# Altium schematic sheet E17-15-MCU.SchDoc
size A; DocumentNumber: 2; SheetNumber: 2; SheetTotal: 9
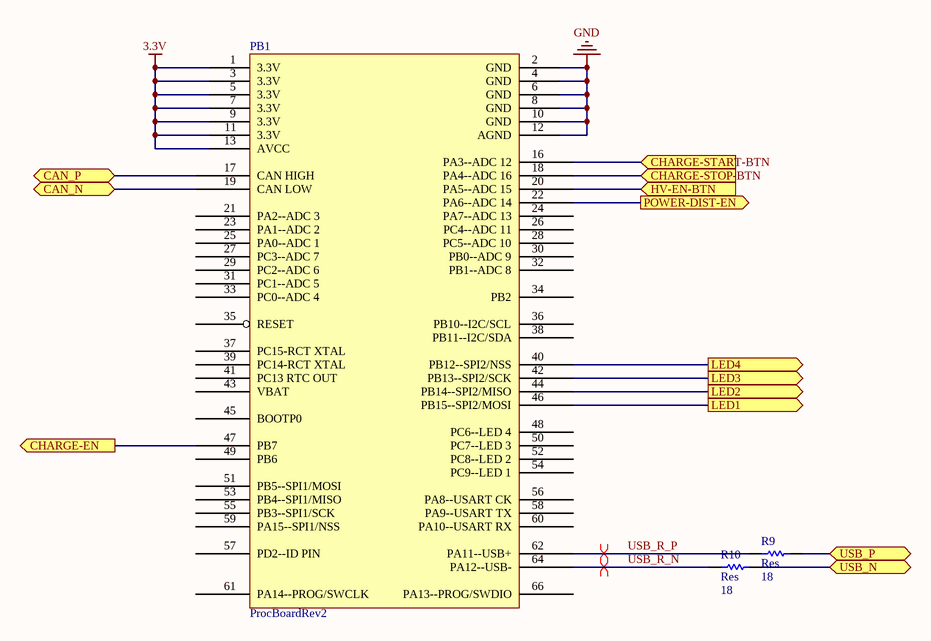
[diagram p0: E17-15-MCU.SchDoc]

## Parts
PB1  ProcBoardRev2  [PROC_BOARD]
R9  Res  value 18  [2012[0805]]
R10  Res  value 18  [2012[0805]]

## Ports
CAN_N (bidir), CAN_P (bidir), CHARGE-EN (out), CHARGE-START-BTN (in), CHARGE-STOP-BTN (in), HV-EN-BTN (in), LED1 (out), LED2 (out), LED3 (out), LED4 (out), POWER-DIST-EN (out), USB_N (bidir), USB_P (bidir)

## Nets
3.3V: PB1.1(3.3V) PB1.3(3.3V) PB1.5(3.3V) PB1.7(3.3V) PB1.9(3.3V) PB1.11(3.3V) PB1.13(AVCC)
GND: PB1.2(GND) PB1.4(GND) PB1.6(GND) PB1.8(GND) PB1.10(GND) PB1.12(AGND)
CAN_N: PB1.19(CAN_LOW) ; port CAN_N
CAN_P: PB1.17(CAN_HIGH) ; port CAN_P
CHARGE-EN: PB1.47(PB7) ; port CHARGE-EN
CHARGE-START-BTN: PB1.16(PA3--ADC_12) ; port CHARGE-START-BTN
CHARGE-STOP-BTN: PB1.18(PA4--ADC_16) ; port CHARGE-STOP-BTN
HV-EN-BTN: PB1.20(PA5--ADC_15) ; port HV-EN-BTN
LED1: PB1.46(PB15--SPI2/MOSI) ; port LED1
LED2: PB1.44(PB14--SPI2/MISO) ; port LED2
LED3: PB1.42(PB13--SPI2/SCK) ; port LED3
LED4: PB1.40(PB12--SPI2/NSS) ; port LED4
POWER-DIST-EN: PB1.22(PA6--ADC_14) ; port POWER-DIST-EN
USB_N: R10.2 ; port USB_N
USB_P: R9.2 ; port USB_P
USB_R_N: PB1.64(PA12--USB-) R10.1
USB_R_P: PB1.62(PA11--USB+) R9.1

Not connected (* = marked no-connect by the designer): PB1 14(NC) 15(NC) 21(PA2--ADC_3) 23(PA1--ADC_2) 24(PA7--ADC_13) 25(PA0--ADC_1) 26(PC4--ADC_11) 27(PC3--ADC_7) 28(PC5--ADC_10) 29(PC2--ADC_6) 30(PB0--ADC_9) 31(PC1--ADC_5) 32(PB1--ADC_8) 33(PC0--ADC_4) 34(PB2) 35(RESET) 36(PB10--I2C/SCL) 37(PC15-RCT_XTAL) 38(PB11--I2C/SDA) 39(PC14-RCT_XTAL) 41(PC13_RTC_OUT) 43(VBAT) 45(BOOTP0) 48(PC6--LED_4) 49(PB6) 50(PC7--LED_3) 51(PB5--SPI1/MOSI) 52(PC8--LED_2) 53(PB4--SPI1/MISO) 54(PC9--LED_1) 55(PB3--SPI1/SCK) 56(PA8--USART_CK) 57(PD2--ID_PIN) 58(PA9--USART_TX) 59(PA15--SPI1/NSS) 60(PA10--USART_RX) 61(PA14--PROG/SWCLK) 63(NC) 65(NC) 66(PA13--PROG/SWDIO) 67

## Layout directives
differential pair: USB_R_N, USB_R_P

## Library data of the parts
PB1 = ProcBoardRev2: Processor board that carries the STM32F072RB
R9 R10 = Res: Surface Mount Resistor; Published: 8-Jun-2000; LatestRevisionDate: 17-Jul-2002; LatestRevisionNote: Re-released for DXP Platform.; PackageReference: AXIAL-0.5; Publisher: Altium Limited